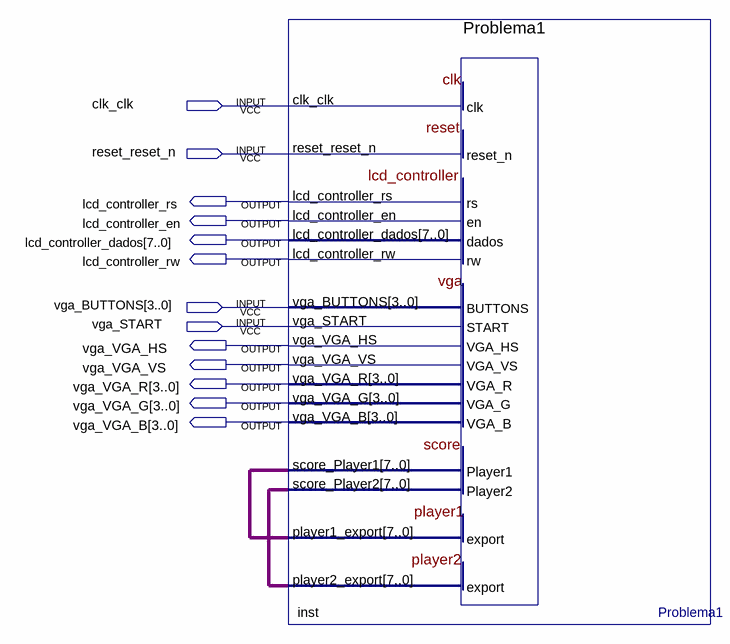
[diagram p0: schematic sheet]
// Quartus schematic Problema3.bdf as structural Verilog: 1 symbols, 13 pins
module Problema3 (
  input  clk_clk,
  input  reset_reset_n,
  input  [3:0] vga_BUTTONS,
  input  vga_START,
  output lcd_controller_rs,
  output lcd_controller_en,
  output [7:0] lcd_controller_dados,
  output lcd_controller_rw,
  output vga_VGA_HS,
  output vga_VGA_VS,
  output [3:0] vga_VGA_R,
  output [3:0] vga_VGA_G,
  output [3:0] vga_VGA_B
);

  wire [7:0] inst_score_player1, inst_score_player2;

  Problema1 inst (
    .clk_clk(clk_clk), .reset_reset_n(reset_reset_n), .vga_BUTTONS(vga_BUTTONS), .vga_START(vga_START),
    .player1_export(inst_score_player1), .player2_export(inst_score_player2),
    .lcd_controller_rs(lcd_controller_rs), .lcd_controller_en(lcd_controller_en),
    .lcd_controller_dados(lcd_controller_dados), .lcd_controller_rw(lcd_controller_rw),
    .vga_VGA_HS(vga_VGA_HS), .vga_VGA_VS(vga_VGA_VS), .vga_VGA_R(vga_VGA_R), .vga_VGA_G(vga_VGA_G),
    .vga_VGA_B(vga_VGA_B), .score_Player1(inst_score_player1), .score_Player2(inst_score_player2));
endmodule
